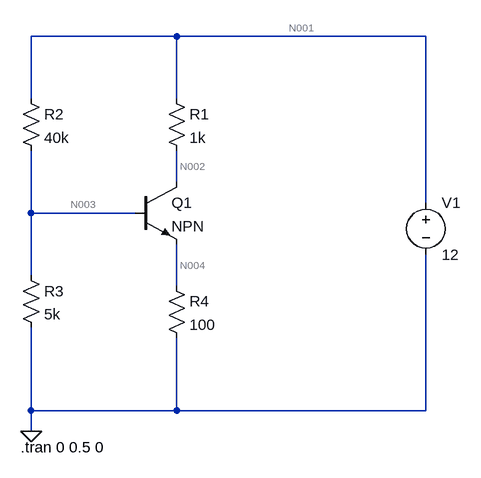
[diagram p0: schematic 3-1.asc]
3-1.asc, the LTspice schematic file:
Version 4.1
SHEET 1 880 680
WIRE 208 -96 -16 -96
WIRE 592 -96 208 -96
WIRE -16 0 -16 -96
WIRE 208 0 208 -96
WIRE 208 128 208 80
WIRE 592 160 592 -96
WIRE -16 176 -16 80
WIRE 144 176 -16 176
WIRE -16 272 -16 176
WIRE 208 288 208 224
WIRE -16 480 -16 352
WIRE 208 480 208 368
WIRE 208 480 -16 480
WIRE 592 480 592 240
WIRE 592 480 208 480
WIRE -16 512 -16 480
FLAG -16 512 0
SYMBOL npn 144 128 R0
SYMATTR InstName Q1
SYMBOL res 192 -16 R0
SYMATTR InstName R1
SYMATTR Value 1k
SYMBOL res -32 -16 R0
SYMATTR InstName R2
SYMATTR Value 40k
SYMBOL res -32 256 R0
SYMATTR InstName R3
SYMATTR Value 5k
SYMBOL res 192 272 R0
SYMATTR InstName R4
SYMATTR Value 100
SYMBOL voltage 592 144 R0
WINDOW 123 0 0 Left 0
WINDOW 39 0 0 Left 0
SYMATTR InstName V1
SYMATTR Value 12
TEXT -32 536 Left 2 !.tran 0 0.5 0

The netlist it stands for:
* 3-1.asc
Q1 N002 N003 N004 0 NPN
R1 N001 N002 1k
R2 N001 N003 40k
R3 N003 0 5k
R4 N004 0 100
V1 N001 0 12
.model NPN NPN
.model PNP PNP
.lib standard.bjt
.tran 0 0.5 0
.backanno
.end

* Results of the author's LTspice run, read from the files saved beside the schematic
* Operating Point, zero values left out:
*   V(n003) = 1.173 V
*   V(n001) = 12 V
*   V(n002) = 8.384 V
*   V(n004) = 365.2 mV
*   Ic(Q1) = 3.616 mA
*   Ib(Q1) = 36.16 µA
*   Ie(Q1) = -3.652 mA
*   I(R2) = 270.7 µA
*   I(R4) = 3.652 mA
*   I(V1) = -3.886 mA
*   I(R3) = 234.5 µA
*   I(R1) = 3.616 mA